# Altium schematic sheet var_10_scheme.SchDoc
size A4; SheetNumber: 10; SheetTotal: 10
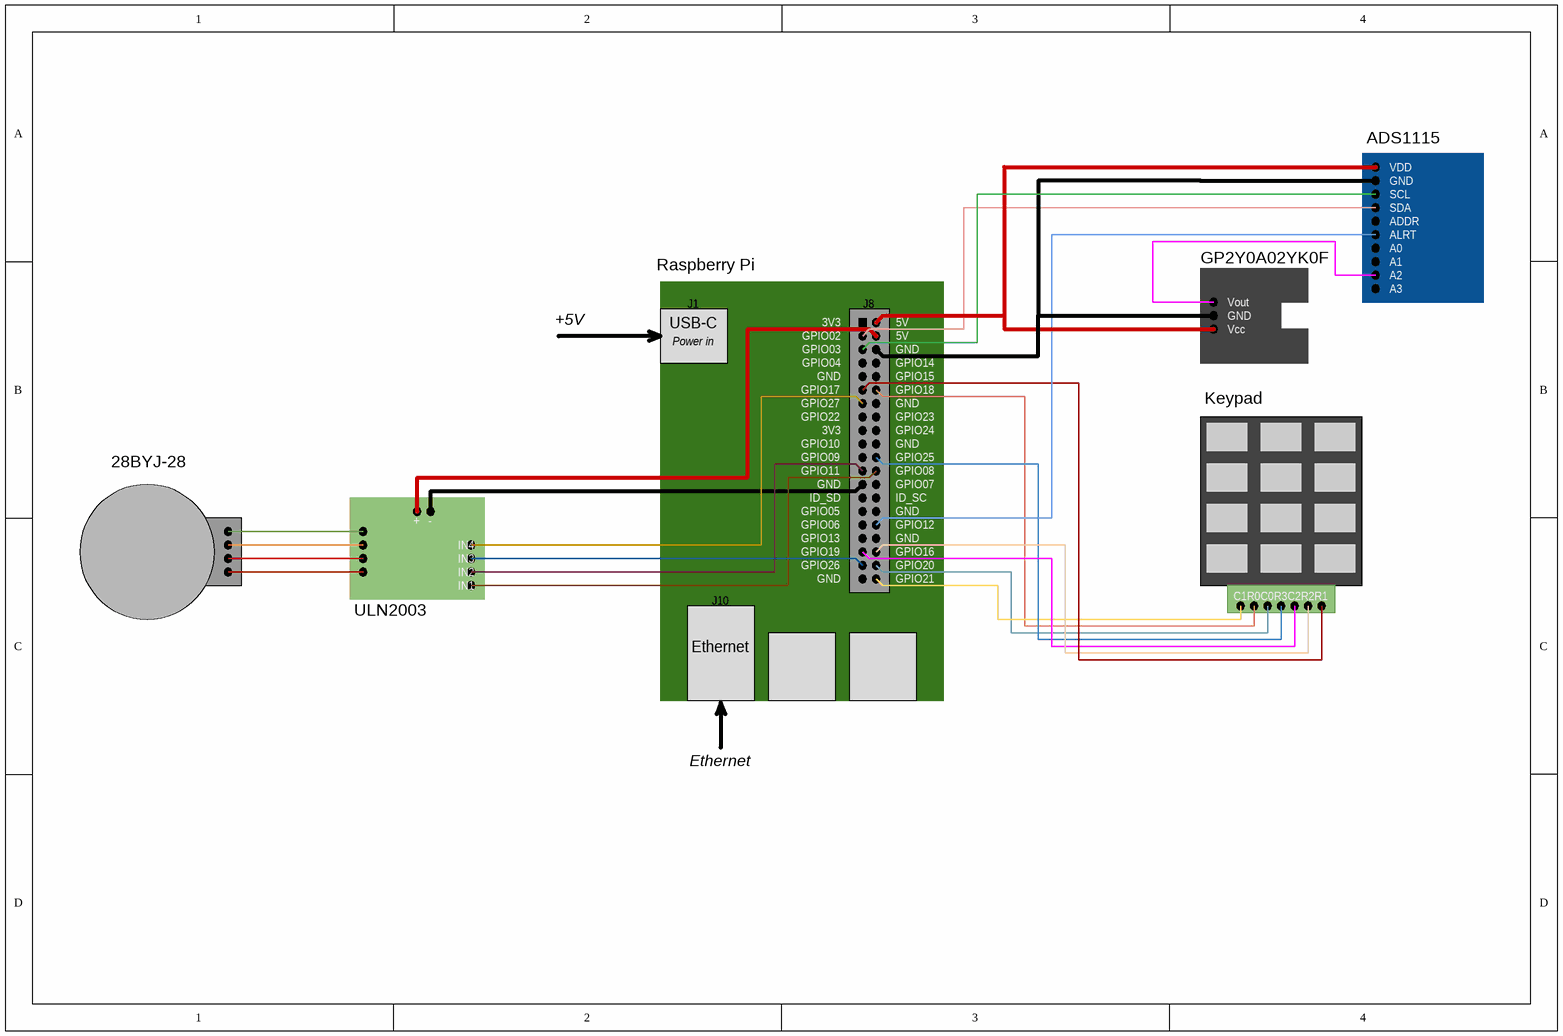
[diagram p0: var_10_scheme.SchDoc]

## Notes on the sheet
- ADS1115
- VDD
- GND
- SCL
- SDA
- ADDR
- ALRT
- A0
- +5V
- Raspberry Pi
- J1
- J8
- GP2Y0A02YK0F
- Vout
- A1
- A2
- A3
- USB-C
- Power in
- GPIO17
- 3V3
- GPIO02
- GPIO03
- GPIO04
- GPIO14
- GPIO15
- GPIO18
- 5V
- Vcc
- GPIO27
- GPIO22
- GPIO10
- GPIO23
- GPIO24
- Keypad
- 28BYJ-28
- +
- -
- GPIO09
- GPIO11
- GPIO05
- GPIO06
- ID_SD
- GPIO25
- GPIO08
- GPIO07
- ID_SC
- GPIO12
- IN4
- IN3
- IN2
- IN1
- GPIO13
- GPIO19
- GPIO26
- GPIO16
- GPIO20
- GPIO21
- ULN2003
- Ethernet
- J10
- C1
- R0
- C0
- R3
- C2
- R2
- R1